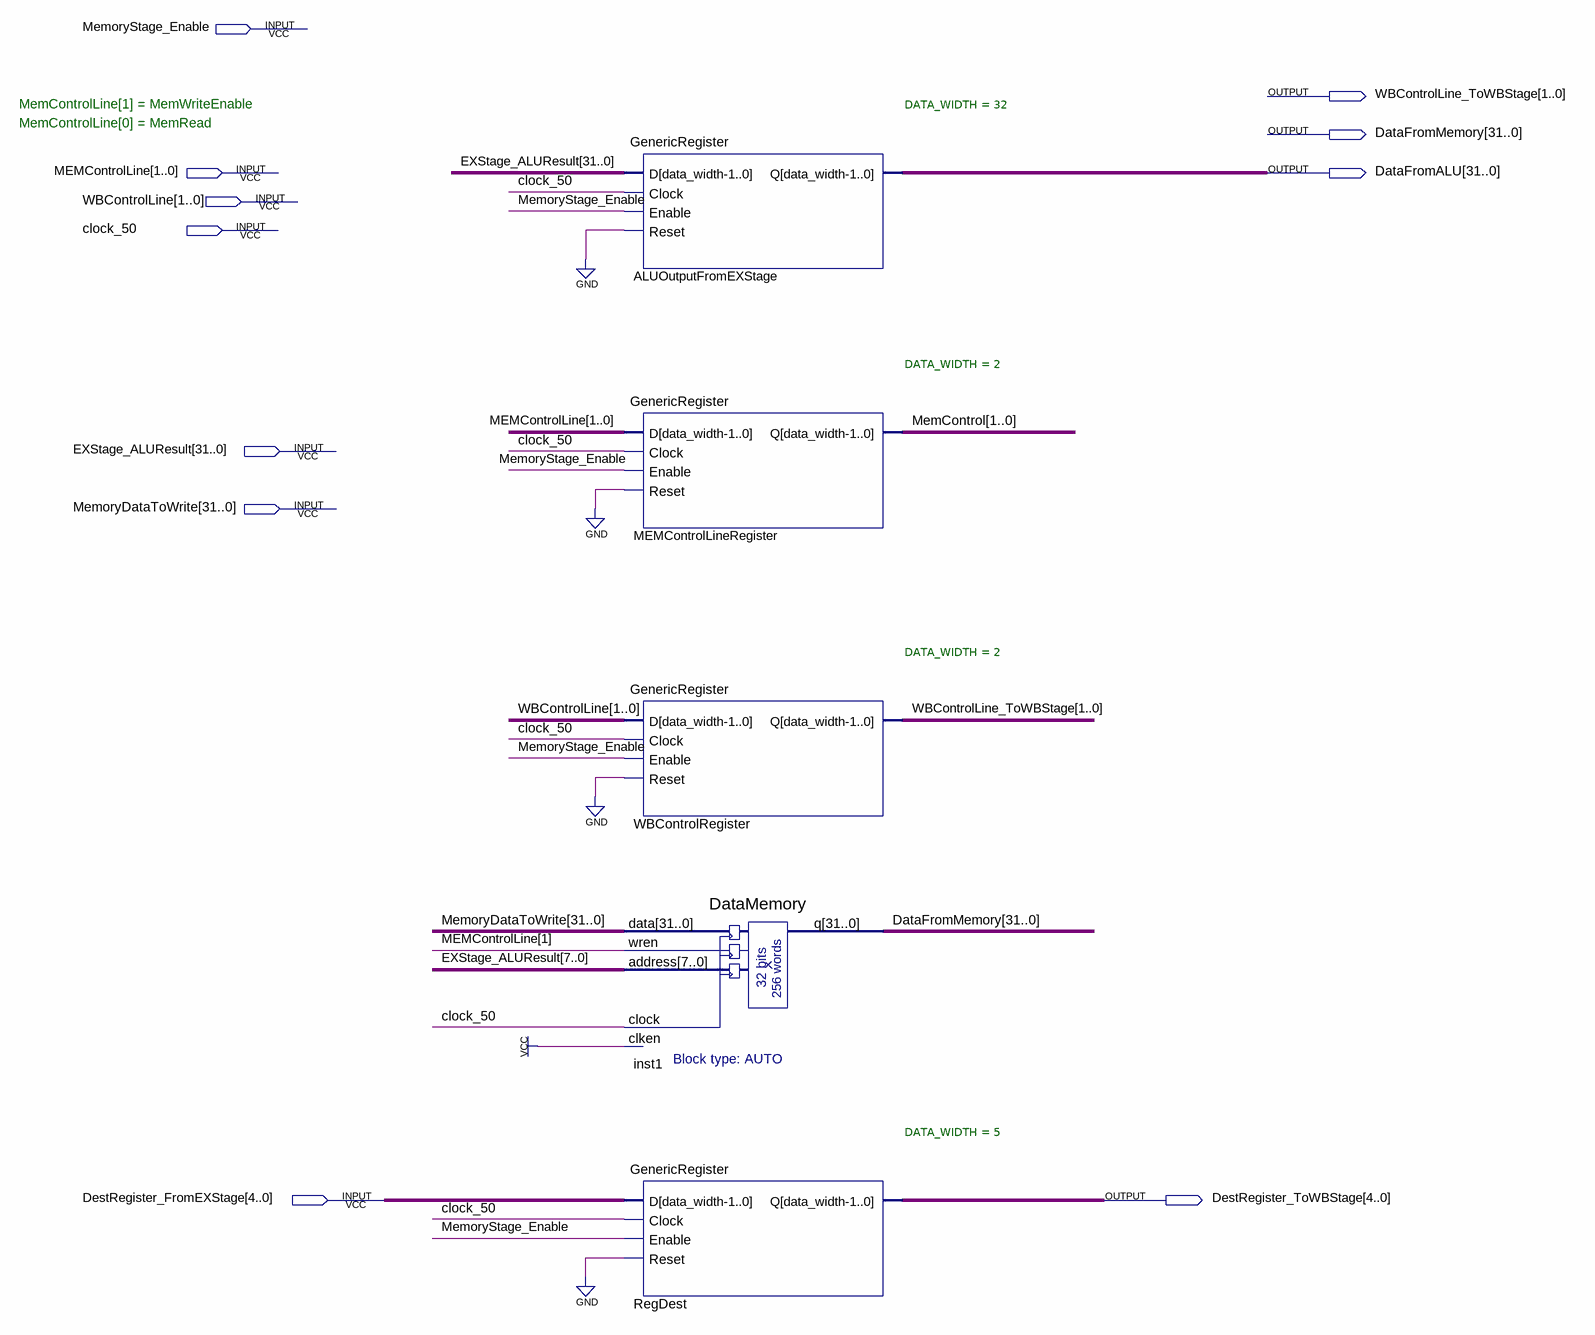
[diagram p0: schematic sheet]
// Quartus schematic Memory_Stage.bdf as structural Verilog: 5 symbols, 11 pins
module Memory_Stage (
  input  MemoryStage_Enable,
  input  [1:0] MEMControlLine,
  input  [1:0] WBControlLine,
  input  clock_50,
  input  [31:0] EXStage_ALUResult,
  input  [31:0] MemoryDataToWrite,
  input  [4:0] DestRegister_FromEXStage,
  output [1:0] WBControlLine_ToWBStage,
  output [31:0] DataFromMemory,
  output [31:0] DataFromALU,
  output [4:0] DestRegister_ToWBStage
);

  wire [1:0] MemControl;

  GenericRegister #(.DATA_WIDTH(32)) ALUOutputFromEXStage (
    .D(EXStage_ALUResult), .Clock(clock_50), .Enable(MemoryStage_Enable), .Reset(1'b0), .Q(DataFromALU));
  GenericRegister #(.DATA_WIDTH(2)) MEMControlLineRegister (
    .D(MEMControlLine), .Clock(clock_50), .Enable(MemoryStage_Enable), .Reset(1'b0), .Q(MemControl));
  GenericRegister #(.DATA_WIDTH(2)) WBControlRegister (
    .D(WBControlLine), .Clock(clock_50), .Enable(MemoryStage_Enable), .Reset(1'b0),
    .Q(WBControlLine_ToWBStage));
  DataMemory inst1 (
    .data(MemoryDataToWrite), .wren(MEMControlLine[1]), .address(EXStage_ALUResult[7:0]), .clock(clock_50),
    .clken(1'b1), .q(DataFromMemory));
  GenericRegister #(.DATA_WIDTH(5)) RegDest (
    .D(DestRegister_FromEXStage), .Clock(clock_50), .Enable(MemoryStage_Enable), .Reset(1'b0),
    .Q(DestRegister_ToWBStage));

  // Notes on the sheet:
  //   MemControlLine[1] = MemWriteEnable
  //   MemControlLine[0] = MemRead
endmodule
